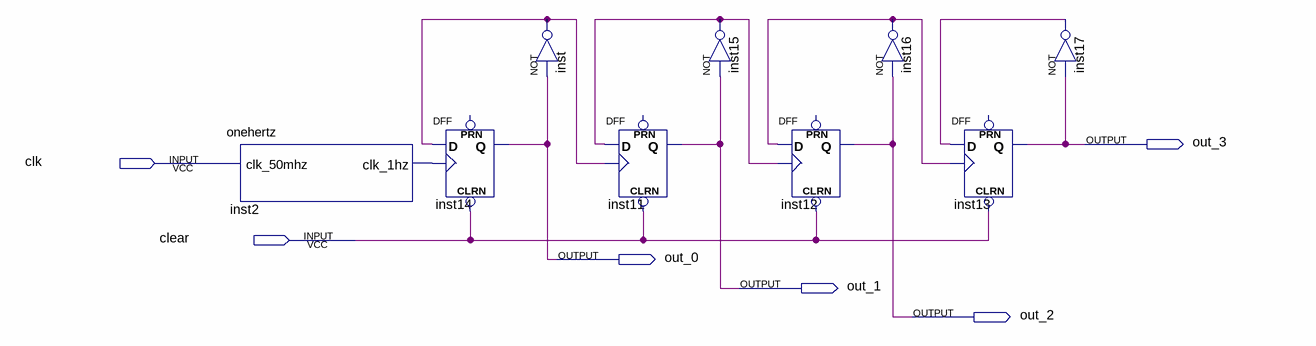
[diagram p0: schematic sheet]
// Quartus schematic Counter_CLK.bdf as structural Verilog: 9 symbols, 6 pins
module Counter_CLK (
  input  clk,
  input  clear,
  output out_3,
  output out_0,
  output out_1,
  output out_2
);

  wire inst2_clk_1hz, inst15_out, inst16_out, inst17_out, inst_out;

  onehertz inst2 (.clk_50mhz(clk), .clk_1hz(inst2_clk_1hz));
  DFF inst14 (.CLRN(clear), .CLK(inst2_clk_1hz), .D(inst_out), .Q(out_0));  // open: PRN
  not inst (inst_out, out_0);
  DFF inst11 (.CLRN(clear), .CLK(inst_out), .D(inst15_out), .Q(out_1));  // open: PRN
  not inst15 (inst15_out, out_1);
  DFF inst12 (.CLRN(clear), .CLK(inst15_out), .D(inst16_out), .Q(out_2));  // open: PRN
  not inst16 (inst16_out, out_2);
  DFF inst13 (.CLRN(clear), .CLK(inst16_out), .D(inst17_out), .Q(out_3));  // open: PRN
  not inst17 (inst17_out, out_3);
endmodule
